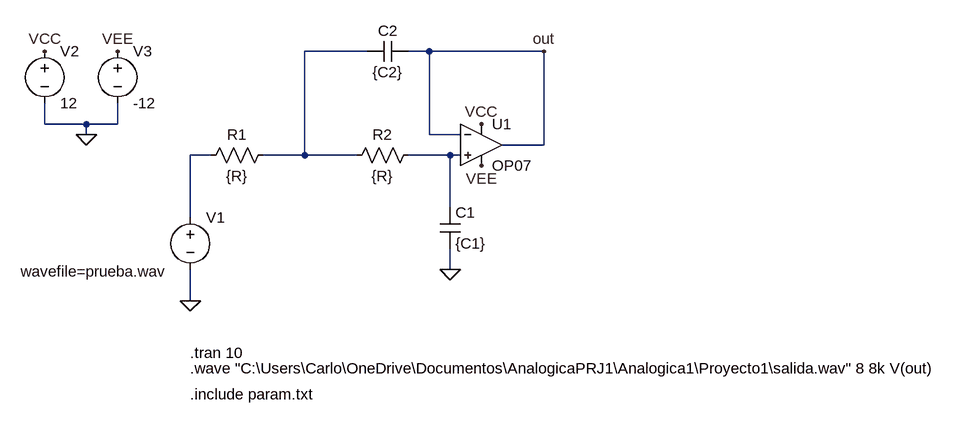
[diagram p0: schematic Test.asc]
Test.asc, the LTspice schematic file:
Version 4
SHEET 1 1528 680
WIRE 368 -112 272 -112
WIRE 464 -112 432 -112
WIRE 640 -112 464 -112
WIRE -128 0 -128 -32
WIRE -64 0 -128 0
WIRE -16 0 -16 -32
WIRE -16 0 -64 0
WIRE -64 16 -64 0
WIRE 464 16 464 -112
WIRE 512 16 464 16
WIRE 640 32 640 -112
WIRE 640 32 576 32
WIRE 128 48 96 48
WIRE 272 48 272 -112
WIRE 272 48 208 48
WIRE 352 48 272 48
WIRE 496 48 432 48
WIRE 512 48 496 48
WIRE 496 128 496 48
WIRE 96 144 96 48
WIRE 496 224 496 192
WIRE 96 272 96 224
FLAG 96 272 0
FLAG 496 224 0
FLAG -64 16 0
FLAG -128 -112 VCC
FLAG 544 0 VCC
FLAG -16 -112 VEE
FLAG 544 64 VEE
FLAG 640 -112 out
SYMBOL voltage 96 128 R0
WINDOW 3 -261 99 Left 2
SYMATTR Value wavefile=prueba.wav
SYMATTR InstName V1
SYMBOL res 224 32 R90
WINDOW 0 0 56 VBottom 2
WINDOW 3 32 56 VTop 2
SYMATTR InstName R1
SYMATTR Value {R}
SYMBOL res 448 32 R90
WINDOW 0 0 56 VBottom 2
WINDOW 3 32 56 VTop 2
SYMATTR InstName R2
SYMATTR Value {R}
SYMBOL cap 480 128 R0
SYMATTR InstName C1
SYMATTR Value {C1}
SYMBOL cap 432 -128 R90
WINDOW 0 0 32 VBottom 2
WINDOW 3 32 32 VTop 2
SYMATTR InstName C2
SYMATTR Value {C2}
SYMBOL OpAmps\\OP07 544 -32 R0
SYMATTR InstName U1
SYMBOL voltage -128 -128 R0
WINDOW 123 0 0 Left 0
WINDOW 39 0 0 Left 0
SYMATTR InstName V2
SYMATTR Value 12
SYMBOL voltage -16 -128 R0
WINDOW 123 0 0 Left 0
WINDOW 39 0 0 Left 0
SYMATTR InstName V3
SYMATTR Value -12
TEXT 96 352 Left 2 !.tran 10
TEXT 96 376 Left 2 !.wave "C:\\Users\\Carlo\\OneDrive\\Documentos\\AnalogicaPRJ1\\Analogica1\\Proyecto1\\salida.wav" 8 8k V(out)
TEXT 96 416 Left 2 !.include param.txt

The netlist it stands for:
* Test.asc
V1 N002 0 wavefile=prueba.wav
R1 N001 N002 {R}
R2 N003 N001 {R}
C1 N003 0 {C1}
C2 out N001 {C2}
XU1 N003 out VCC VEE out LT1001  ; OP07, pins In+ In- V+ V- OUT
V2 VCC 0 12
V3 VEE 0 -12
.tran 10
.wave "C:\Users\Carlo\OneDrive\Documentos\AnalogicaPRJ1\Analogica1\Proyecto1\salida.wav" 8 8k V(out)
.include param.txt
.lib LTC.lib
.backanno
.end

* Results of the author's LTspice run, read from the files saved beside the schematic
* Operating Point, zero values left out:
*   V(vcc) = 12 V
*   V(vee) = -12 V
*   I(V3) = 2.25 mA
*   I(V2) = -2.25 mA
*   Ix(u1:3) = 2.25 mA
*   Ix(u1:4) = -2.25 mA